# EAGLE design PCB-MicroGPIO (EAGLE 7.5.0)

## Sheet 1 of 2
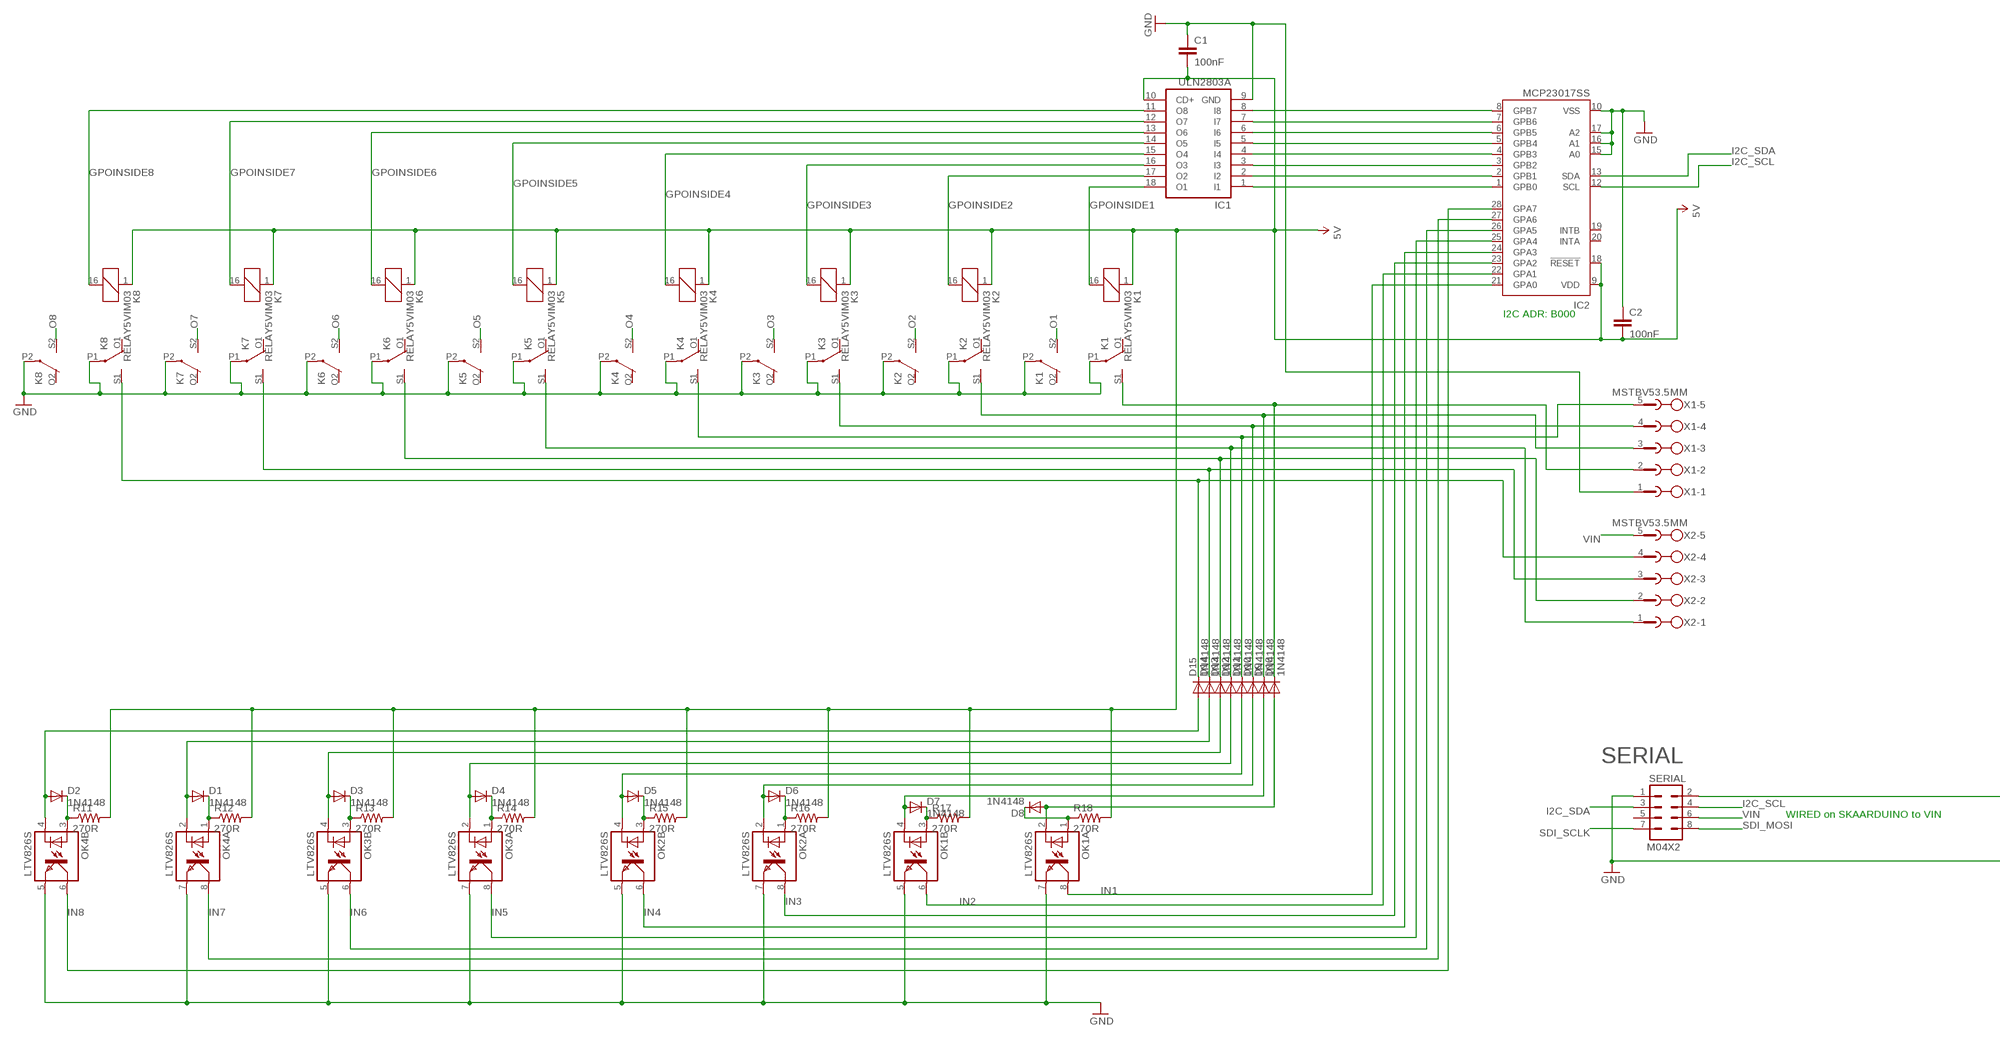
[diagram p0: schematic, sheet 1, part 1 of 2]
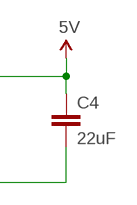
[diagram p1: schematic, sheet 1, part 2 of 2]

### Parts
C1  100nF  CAP0603-CAP  [0603-CAP]
C2  100nF  CAP0603-CAP  [0603-CAP]
C4  22uF  CAP0805  [0805]
D1  1N4148  DIODESOD  [SOD-323]
D2  1N4148  DIODESOD  [SOD-323]
D3  1N4148  DIODESOD  [SOD-323]
D4  1N4148  DIODESOD  [SOD-323]
D5  1N4148  DIODESOD  [SOD-323]
D6  1N4148  DIODESOD  [SOD-323]
D7  1N4148  DIODESOD  [SOD-323]
D8  1N4148  DIODESOD  [SOD-323]
D9  1N4148  DIODESOD  [SOD-323]
D10  1N4148  DIODESOD  [SOD-323]
D11  1N4148  DIODESOD  [SOD-323]
D12  1N4148  DIODESOD  [SOD-323]
D13  1N4148  DIODESOD  [SOD-323]
D14  1N4148  DIODESOD  [SOD-323]
D15  1N4148  DIODESOD  [SOD-323]
D16  1N4148  DIODESOD  [SOD-323]
IC1  ULN2803A  ULN2803ASO18W  [SO18W]
IC2  MCP23017SS  [SSOP28]
K1  RELAY5VIM03  [DS2Y]
K2  RELAY5VIM03  [DS2Y]
K3  RELAY5VIM03  [DS2Y]
K4  RELAY5VIM03  [DS2Y]
K5  RELAY5VIM03  [DS2Y]
K6  RELAY5VIM03  [DS2Y]
K7  RELAY5VIM03  [DS2Y]
K8  RELAY5VIM03  [DS2Y]
OK1  LTV826S  [DIL8-SMD]
OK2  LTV826S  [DIL8-SMD]
OK3  LTV826S  [DIL8-SMD]
OK4  LTV826S  [DIL8-SMD]
R11  270R  RESISTOR0603-RES  [0603-RES]
R12  270R  RESISTOR0603-RES  [0603-RES]
R13  270R  RESISTOR0603-RES  [0603-RES]
R14  270R  RESISTOR0603-RES  [0603-RES]
R15  270R  RESISTOR0603-RES  [0603-RES]
R16  270R  RESISTOR0603-RES  [0603-RES]
R17  270R  RESISTOR0603-RES  [0603-RES]
R18  270R  RESISTOR0603-RES  [0603-RES]
SERIAL  M04X2  [2X4]
X1  MSTBV53.5MM  [MSTBV5-3.5]
X2  MSTBV53.5MM  [MSTBV5-3.5]

### Nets
5V [Power]: C1.2 C2.2 C4.1 IC1.10(CD+) IC2.9(VDD) IC2.18(!RESET) K1.1 K2.1 K3.1 K4.1 K5.1 K6.1 K7.1 K8.1 R11.2 R12.2 R13.2 R14.2 R15.2 R16.2 R17.2 R18.2 SERIAL.2
GND [Power]: C1.1 C2.1 C4.2 IC1.9(GND) IC2.10(VSS) IC2.15(A0) IC2.16(A1) IC2.17(A2) K1.P1(2:P) K1.P2(3:P) K2.P1(2:P) K2.P2(3:P) K3.P1(2:P) K3.P2(3:P) K4.P1(2:P) K4.P2(3:P) K5.P1(2:P) K5.P2(3:P) K6.P1(2:P) K6.P2(3:P) K7.P1(2:P) K7.P2(3:P) K8.P1(2:P) K8.P2(3:P) OK1.5(B:EMIT) OK1.7(A:EMIT) OK2.5(B:EMIT) OK2.7(A:EMIT) OK3.5(B:EMIT) OK3.7(A:EMIT) OK4.5(B:EMIT) OK4.7(A:EMIT) SERIAL.1 X1.1
GPOINSIDE1: IC1.18(O1) K1.16
GPOINSIDE2: IC1.17(O2) K2.16
GPOINSIDE3: IC1.16(O3) K3.16
GPOINSIDE4: IC1.15(O4) K4.16
GPOINSIDE5: IC1.14(O5) K5.16
GPOINSIDE6: IC1.13(O6) K6.16
GPOINSIDE7: IC1.12(O7) K7.16
GPOINSIDE8: IC1.11(O8) K8.16
I2C_SCL: IC2.12(SCL) SERIAL.4
I2C_SDA: IC2.13(SDA) SERIAL.3
IN1: IC2.21(GPA0) OK1.8(A:COL)
IN2: IC2.22(GPA1) OK1.6(B:COL)
IN3: IC2.23(GPA2) OK2.8(A:COL)
IN4: IC2.24(GPA3) OK2.6(B:COL)
IN5: IC2.25(GPA4) OK3.8(A:COL)
IN6: IC2.26(GPA5) OK3.6(B:COL)
IN7: IC2.27(GPA6) OK4.8(A:COL)
IN8: IC2.28(GPA7) OK4.6(B:COL)
N$1 [INput lines]: D2.2(A) D15.2(A) OK4.4(B:C)
N$2 [INput lines]: D1.2(A) D14.2(A) OK4.2(A:C)
N$3 [INput lines]: D3.2(A) D13.2(A) OK3.4(B:C)
N$4 [INput lines]: D4.2(A) D12.2(A) OK3.2(A:C)
N$5: IC1.1(I1) IC2.1(GPB0)
N$6 [INput lines]: D5.2(A) D11.2(A) OK2.4(B:C)
N$7 [INput lines]: D6.2(A) D10.2(A) OK2.2(A:C)
N$8 [INput lines]: D7.2(A) D9.2(A) OK1.4(B:C)
N$9 [INput lines]: D8.2(A) D16.2(A) OK1.2(A:C)
N$13: D2.1(C) OK4.3(B:A) R11.1
N$15: D1.1(C) OK4.1(A:A) R12.1
N$16: D3.1(C) OK3.3(B:A) R13.1
N$17: D4.1(C) OK3.1(A:A) R14.1
N$19: D5.1(C) OK2.3(B:A) R15.1
N$20: D6.1(C) OK2.1(A:A) R16.1
N$21: D7.1(C) OK1.3(B:A) R17.1
N$23: D8.1(C) OK1.1(A:A) R18.1
N$34: IC1.2(I2) IC2.2(GPB1)
N$35: IC1.3(I3) IC2.3(GPB2)
N$36: IC1.4(I4) IC2.4(GPB3)
N$37: IC1.5(I5) IC2.5(GPB4)
N$38: IC1.6(I6) IC2.6(GPB5)
N$39: IC1.7(I7) IC2.7(GPB6)
N$40: IC1.8(I8) IC2.8(GPB7)
N$49 [RELAY LINES]: D16.1(C) K1.S1(2:S) X1.2
N$55 [RELAY LINES]: D12.1(C) K5.S1(2:S) X2.1
N$60 [RELAY LINES]: D9.1(C) K2.S1(2:S) X1.3
N$61 [RELAY LINES]: D10.1(C) K3.S1(2:S) X1.4
N$62 [RELAY LINES]: D11.1(C) K4.S1(2:S) X1.5
N$64 [RELAY LINES]: D13.1(C) K6.S1(2:S) X2.2
N$65 [RELAY LINES]: D14.1(C) K7.S1(2:S) X2.3
N$66 [RELAY LINES]: D15.1(C) K8.S1(2:S) X2.4
O1: K1.S2(3:S)
O2: K2.S2(3:S)
O3: K3.S2(3:S)
O4: K4.S2(3:S)
O5: K5.S2(3:S)
O6: K6.S2(3:S)
O7: K7.S2(3:S)
O8: K8.S2(3:S)
SDI_MOSI: SERIAL.8
SDI_SCLK: SERIAL.7
VIN: SERIAL.6 X2.5
Unconnected: IC2.19(INTB) IC2.20(INTA) K1.O1(2:O) K1.O2(3:O) K2.O1(2:O) K2.O2(3:O) K3.O1(2:O) K3.O2(3:O) K4.O1(2:O) K4.O2(3:O) K5.O1(2:O) K5.O2(3:O) K6.O1(2:O) K6.O2(3:O) K7.O1(2:O) K7.O2(3:O) K8.O1(2:O) K8.O2(3:O) SERIAL.5

### Notes on the sheet
- I2C ADR: B000
- SERIAL
- WIRED on SKAARDUINO to VIN

## Sheet 2 of 2

## Library data of the parts
C1 C2 C4 = SparkFun:CAP: Capacitor Standard 0603 ceramic capacitor, and 0.1" leaded capacitor.
D1-D16 = SparkFun:DIODE: Diode These are standard reverse protection diodes and small signal diodes. SMA package can handle up to about 1A. SOD-323 can handle about 200mA. What the SOD-323 package when ordering, there are some mfgs out there that are 5-pin packages.
IC1 = uln-udn:ULN2803A: DRIVER ARRAY
IC2 = microchip:MCP23017: http://ww1.microchip.com/downloads/en/DeviceDoc/21952a.pdf Source: http://ww1.microchip.com/downloads/en/DeviceDoc/21952a.pdf; MF: MICROCHIP; MPN: MCP23017-E/SS; OC_FARNELL: 1467674; OC_NEWARK: 31K2960
K1-K8 = SKAARHOJ:RELAY5V: RELAY 2 x switch, AxiCom 150 mW 5V
OK1-OK4 = optocoupler:LTV826: OPTO COUPLER Source: LITEON, LTV816.pdf; OC_FARNELL: unknown; OC_NEWARK: unknown
R11-R18 = SparkFun:RESISTOR: Resistor Basic schematic elements and footprints for 0603, 1206, and PTH resistors.
SERIAL = SparkFun:M04X2
X1 X2 = SKAARHOJ:MSTBV5: PHOENIX

## Net classes
0 default: width 0.203 mm, drill 0.406 mm, clearance 0.203 mm
1 Power: width 0.406 mm, drill 0.61 mm, clearance 0.305 mm
2 RELAY LINES: width 0.406 mm, drill 0.61 mm, clearance 0.305 mm
3 INput lines: width 0.203 mm, drill 0.406 mm, clearance 0.254 mm

## Board
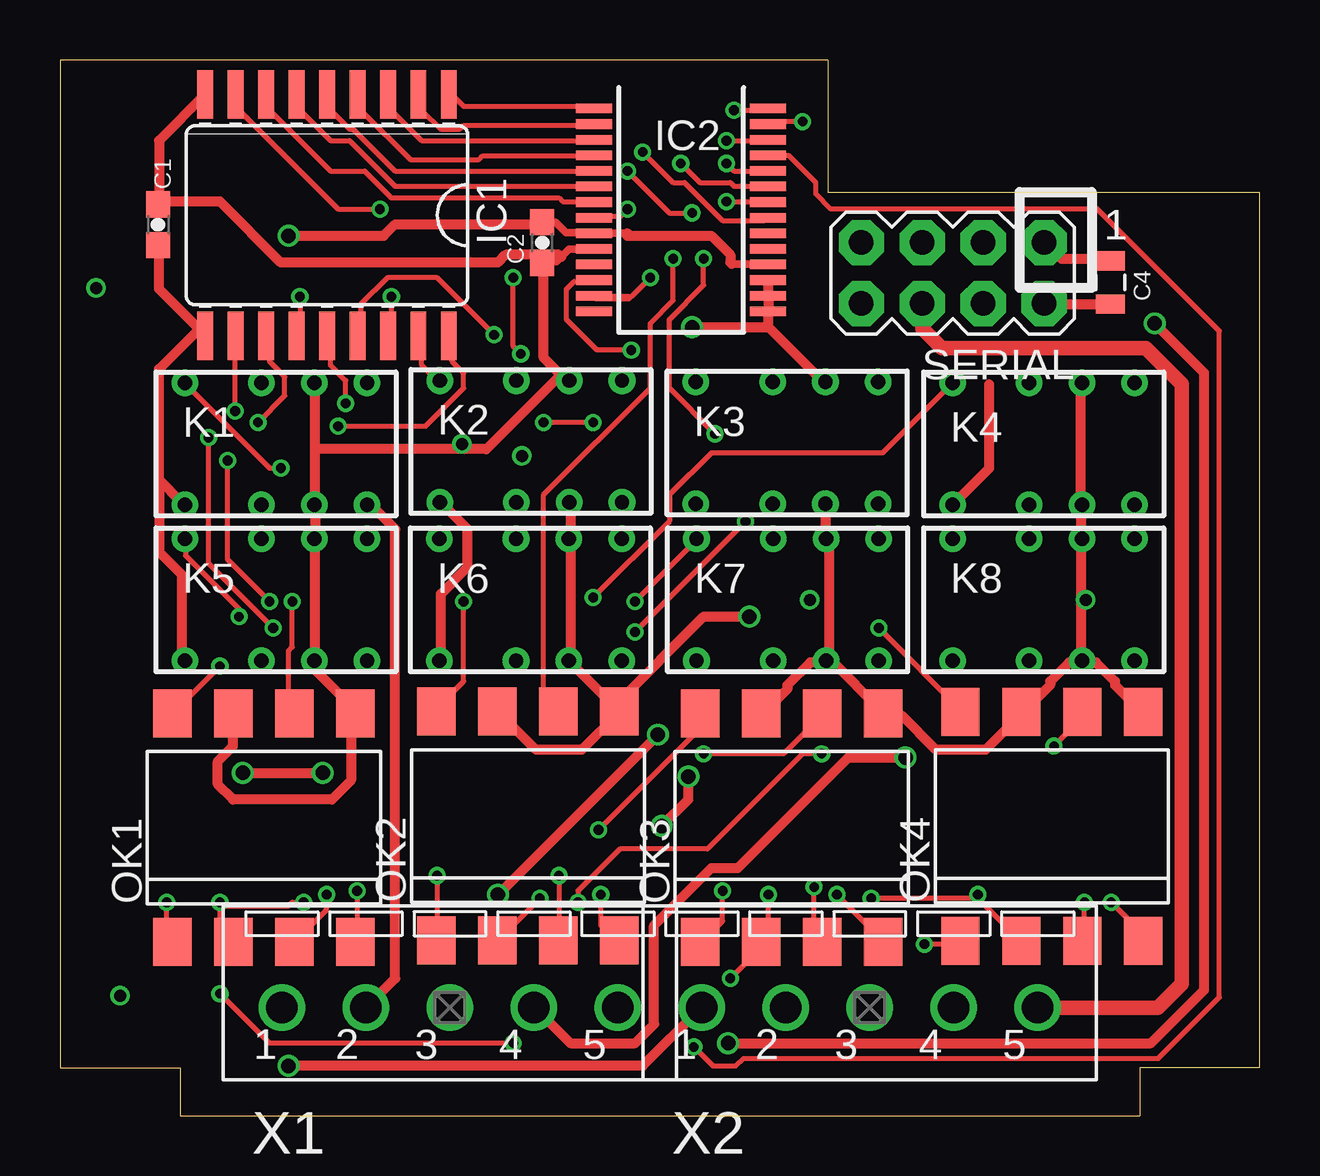
[diagram p2: board, top side]
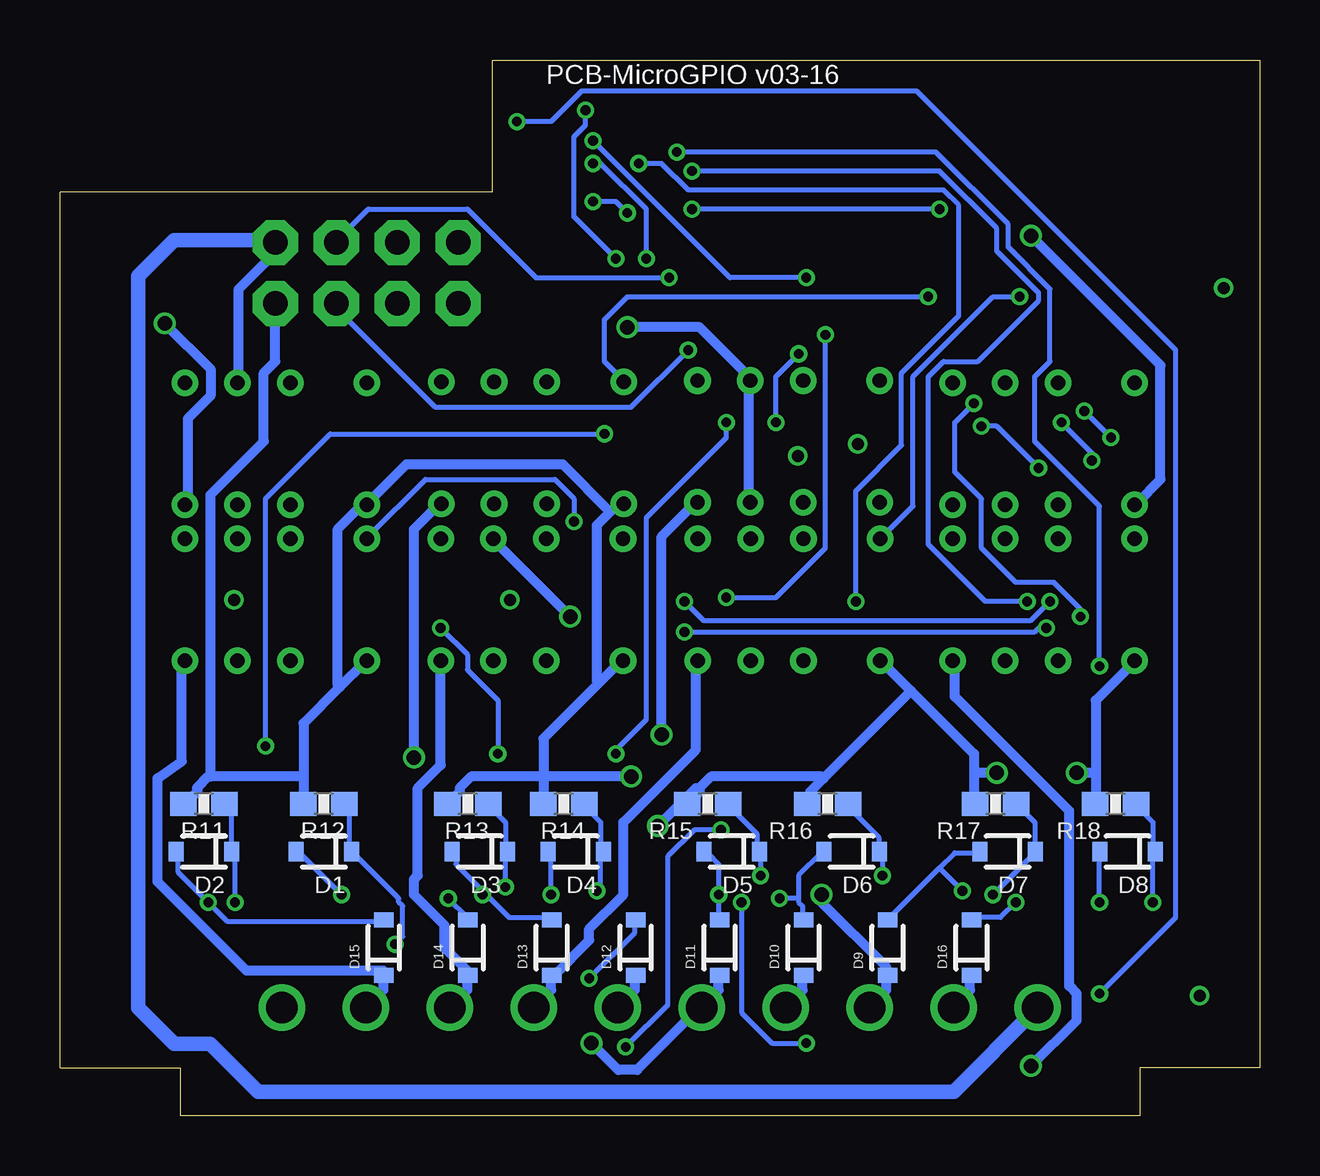
[diagram p3: board, bottom side, seen from below]

Size 50 x 44 mm. Coordinates in mm from the lower left corner, seen from the top.
Outline: 50,2 50,38.5 32,38.5 32,44 0,44 0,2 5,2 5,0 45,0 45,2 50,2
Copper layers (1*16): Top 0.035mm / dielectric 1.5mm / Bottom 0.035mm
Design rules "Fusion_eagle_rule_v1.1": minimum track width 6mil, minimum drill 12mil, track to track 6mil, track to pad 6mil, pad to pad 6mil, via to via 6mil, smd to smd 0mil, copper to edge 10mil, drill to drill 10mil, minimum pad ring 10mil, minimum via ring 6mil, stop-mask expansion 2mil, vias tented up to drill 100mil, thermal gap 10mil

### Footprints (pad centres in the part's own frame; a part is rotated, then mirrored left to right if it is on the bottom)
0603-CAP = smd 1.1 x 1: 1 -0.85,0; 2 0.85,0
0805 = smd 0.8 x 1.2: 1 -0.9,0; 2 0.9,0
SOD-323 = smd 0.63 x 0.83: 1 -1.15,0; 2 1.15,0
SO18W = smd 0.66 x 2.032: 1 -5.08,-5.029; 2 -3.81,-5.029; 3 -2.54,-5.029; 4 -1.27,-5.029; 5 0,-5.029; 6 1.27,-5.029; 7 2.54,-5.029; 8 3.81,-5.029; 9 5.08,-5.029; 10 5.08,5.029; 11 3.81,5.029; 12 2.54,5.029; 13 1.27,5.029; 14 0,5.029; 15 -1.27,5.029; 16 -2.54,5.029; 17 -3.81,5.029; 18 -5.08,5.029
SSOP28 = smd 0.4 x 1.5: 1 -4.225,-3.625; 2 -3.575,-3.625; 3 -2.925,-3.625; 4 -2.275,-3.625; 5 -1.625,-3.625; 6 -0.975,-3.625; 7 -0.325,-3.625; 8 0.325,-3.625; 9 0.975,-3.625; 10 1.625,-3.625; 11 2.275,-3.625; 12 2.925,-3.625; 13 3.575,-3.625; 14 4.225,-3.625; 15 4.225,3.625; 16 3.575,3.625; 17 2.925,3.625; 18 2.275,3.625; 19 1.625,3.625; 20 0.975,3.625; 21 0.325,3.625; 22 -0.325,3.625; 23 -0.975,3.625; 24 -1.625,3.625; 25 -2.275,3.625; 26 -2.925,3.625; 27 -3.575,3.625; 28 -4.225,3.625
DS2Y = drill 0.6: 1 1.2,0.46; 16 1.2,5.54; O1 4.4,0.46; O2 4.4,5.54; P1 6.6,0.46; P2 6.6,5.54; S1 8.8,0.46; S2 8.8,5.54
DIL8-SMD = smd 1.6 x 2: 1 -3.81,-4.77; 2 -1.27,-4.77; 3 1.27,-4.77; 4 3.81,-4.77; 5 3.81,4.77; 6 1.27,4.77; 7 -1.27,4.77; 8 -3.81,4.77
0603-RES = smd 1.1 x 1: 1 -0.85,0; 2 0.85,0
2X4 = drill 1.016 pad 1.88 octagon: 1 -3.81,-1.27; 2 -3.81,1.27; 3 -1.27,-1.27; 4 -1.27,1.27; 5 1.27,-1.27; 6 1.27,1.27; 7 3.81,-1.27; 8 3.81,1.27
MSTBV5-3.5 = drill 1.3: 1 -7,0; 2 -3.5,0; 3 0,0; 4 3.5,0; 5 7,0

### Placement (x,y rotation side)
C1  4.09,37.13 270 top
C2  20.1,36.39 90 top
C4  43.78,34.73 90 top
D1  39,11 180 bottom
D2  44,11 180 bottom
D3  32.5,11 180 bottom
D4  28.5,11 180 bottom
D5  22,11 180 bottom
D6  17,11 180 bottom
D7  10.5,11 180 bottom
D8  5.5,11 180 bottom
D9  15.5,7 90 bottom
D10  19,7 90 bottom
D11  22.5,7 90 bottom
D12  26,7 90 bottom
D13  29.5,7 90 bottom
D14  33,7 90 bottom
D15  36.5,7 90 bottom
D16  12,7 90 bottom
IC1  11.13,37.53 180 top
IC2  25.89,37.75 270 top
K1  4,25 0 top
K2  14.63,25.1 0 top
K3  25.31,25.04 0 top
K4  36,25 0 top
K5  4,18.5 0 top
K6  14.61,18.5 0 top
K7  25.33,18.5 0 top
K8  36,18.5 0 top
OK1  8.5,12 0 top
OK2  19.5,12.06 0 top
OK3  30.5,12 0 top
OK4  41.34,12.05 0 top
R11  44,13 180 bottom
R12  39,13 180 bottom
R13  33,13 180 bottom
R14  29,13 180 bottom
R15  23,13 180 bottom
R16  18,13 180 bottom
R17  11,13 180 bottom
R18  6,13 180 bottom
SERIAL  37.21,35.12 180 top
X1  16.25,4.5 0 top
X2  33.75,4.5 0 top

### Tracks (layer width: path | path; a pad name or v marks a point on that pad's centre or on a via)
5V  (via drill 0.61)
  Top 0.305: C2.2 20.66,37.24 21.1,36.8 22.24,36.8 IC2.9 23.65,36.77 23.68,36.77 23.7,36.8 | IC2.18 29.49,35.5 28,35.5
  Top 0.406: C4.1 43.66,33.81 41.12,33.81 SERIAL.2 | 38.73,30.48 38.73,26.99 37.31,25.56 K4.1 | K2.1 15.88,25.4 16.03,25.4 16.99,24.45 16.99,22.86 15.88,21.75 15.88,19.05 K6.1 | 5.79,32.78 6.03,32.54 IC1.10 | 5.79,32.78 4.13,34.45 4.13,36.2 C1.2 | 28,35.5 27.94,35.56 27.94,35.88 27.15,36.67 23.65,36.67 23.65,36.77 | v9.53,36.67 13.49,36.67 13.97,37.15 20,37.15 C2.2 | 5.79,32.78 4.13,31.11 4.13,26.51 | 4.13,26.51 5.08,25.56 K1.1 | 4.13,26.51 4.13,23.5 5.08,22.54 5.08,19.05 K5.1 | v7.62,14.29 v10.95,14.29 | v26.19,14.13 26.19,13.18 v25.08,12.06
  Bottom 0.406: 29.84,14.13 29.84,15.72 27.54,18.02 | 29.84,14.13 29.84,13.02 R14.2 | 27.54,18.02 26.67,18.89 K7.1 | 29.84,14.13 32.86,14.13 33.34,13.65 33.34,13.49 33.81,13.02 R13.2 | 27.07,25.16 27.62,24.61 27.62,18.1 27.54,18.02 | 27.07,25.16 26.83,25.4 26.51,25.4 K3.1 | 39.85,14.13 39.85,16.35 38.34,17.86 | 39.85,14.13 39.85,13.02 R12.2 | 38.34,17.86 37.31,18.89 K8.1 | 39.85,14.13 43.72,14.13 | 43.72,14.13 43.81,14.13 44.29,13.65 44.29,13.49 44.77,13.02 R11.2 | 38.34,17.86 38.42,17.94 38.42,24.45 37.47,25.4 37.31,25.4 K4.1 37.15,25.56 35.56,27.15 29.05,27.15 27.07,25.16 | 11.91,14.29 11.91,15.08 14.53,17.7 | 11.91,14.29 11.91,13.02 R17.2 | 14.53,17.7 15.72,18.89 K6.1 | 14.53,17.7 18.18,14.05 | 18.18,14.05 18.73,13.49 18.73,13.02 R16.2 | 23.34,13.65 23.34,13.49 23.81,13.02 R15.2 | 23.34,13.65 22.86,14.13 18.26,14.13 18.18,14.05 | 6.83,14.29 6.83,17.3 5.24,18.89 K5.1 | 6.83,14.29 6.83,13.02 R18.2 | v9.53,36.67 4.13,31.27 4.13,26.51 5.08,25.56 K1.1 | v10.95,14.29 11.91,14.29 | 6.83,14.29 v7.62,14.29 | v26.19,14.13 29.84,14.13 | v25.08,12.06 23.5,13.65 23.34,13.65 | 43.72,14.13 43.72,25.88 41.5,28.1 41.5,30.96 41.02,31.43 41.02,33.81 SERIAL.2
GND  (via drill 0.5, 0.61)
  Top 0.305: IC2.10 21.23,36.12 20.89,35.79 20.7,35.6 20.16,35.6 C2.1
  Top 0.406: 10.64,27.78 10.64,25.56 K1.P1 10.64,25.4 10.64,24.13 K5.P2 10.64,23.97 10.64,19.05 K5.P1 10.64,18.89 10.64,18.57 12.38,16.83 OK1.5 12.13,16.67 12.13,13.97 11.34,13.18 7.21,13.18 6.58,13.81 6.58,14.76 7.21,15.4 7.21,16.67 OK1.7 | 10.64,27.78 10.64,30.48 K1.P2 | K3.P1 31.91,25.4 31.91,24.13 K7.P2 32.07,23.97 32.07,19.21 K7.P1 | OK3.7 29.37,16.83 30.32,17.78 30.32,17.94 31.27,18.89 31.91,18.89 K7.P1 | K7.P1 32.07,19.05 34.29,16.83 OK3.5 34.45,16.67 35.08,16.67 36.51,15.24 38.58,15.24 40.01,16.67 OK4.7 40.16,16.83 41.27,17.94 41.27,18.1 42.07,18.89 42.55,18.89 K8.P1 | OK4.5 45.09,16.83 43.97,17.94 43.97,18.1 43.18,18.89 42.7,18.89 K8.P1 | C4.2 43.66,35.72 41.75,35.72 41.12,36.35 SERIAL.1 | K4.P2 42.55,30.48 42.55,25.56 K4.P1 42.55,25.4 42.55,24.13 K8.P2 42.55,23.97 42.55,19.05 K8.P1 | OK2.7 18.26,16.83 19.84,15.24 21.75,15.24 23.34,16.83 OK2.5 | OK2.5 23.18,16.99 21.27,18.89 K6.P1 21.27,19.05 21.27,23.97 K6.P2 21.27,24.13 21.27,25.4 K2.P1 | IC2.17 29.53,34.77 29.53,34.29 IC2.16 29.53,34.13 29.53,33.66 IC2.15 29.53,33.34 29.53,32.86 | 29.53,32.86 31.75,30.64 K3.P2 | IC1.9 6.03,42.55 4.13,40.64 4.13,38.1 C1.1 4.29,38.1 6.67,38.1 9.21,35.56 18.26,35.56 18.57,35.88 20.8,35.88 20.89,35.79 | C2.1 20.16,35.4 20.16,31.59 21.11,30.64 K2.P2 20.8,30.8 17.78,27.78 10.64,27.78 | v26.35,32.86 29.53,32.86 | v28.73,20.8 26.83,20.8 23.18,17.14 OK2.5
  Bottom 0.406: SERIAL.1 41.12,36.35 41.12,35.88 42.55,34.45 42.55,30.64 K4.P2 | K2.P1 21.27,25.56 21.27,30.48 K2.P2 21.27,30.8 23.34,32.86 v26.35,32.86 | v28.73,20.8 31.91,23.97 K7.P2 | X1.1 9.28,4.6 9.37,4.38
  Bottom 0.61: 9.37,4.45 9.37,4.38 12.75,1 41.75,1 43.75,3 45.25,3 46.75,4.5 46.75,35 45.25,36.5 41.13,36.5 SERIAL.1
  other vias: 2.5,5 1.5,34.5 19.25,27.5 31.25,21.5 42.75,21.5 16.75,28
GPOINSIDE1  (via drill 0.41)
  Top 0.203: v11.59,28.73 15.24,28.73 16.83,30.32 16.83,30.96 16.35,31.43 16.35,32.38 IC1.18 | v9.21,26.99 8.73,26.99 5.24,30.48 K1.16
  Bottom 0.203: v11.59,28.73 10.95,28.73 v9.21,26.99
GPOINSIDE2
  Top 0.203: IC1.17 15.08,32.38 15.08,31.27 15.72,30.64 K2.16
GPOINSIDE3  (via drill 0.41)
  Top 0.203: v13.81,34.13 13.81,32.54 IC1.16
  Bottom 0.203: v13.81,34.13 26.35,34.13 27.3,33.18 27.3,31.43 26.51,30.64 K3.16
GPOINSIDE4  (via drill 0.41)
  Top 0.203: v18.1,32.54 15.72,34.92 13.65,34.92 12.54,33.81 12.54,32.54 IC1.15 | v22.23,21.59 25.4,24.77 25.4,25.88 27.15,27.62 34.29,27.62 37.15,30.48 K4.16
  Bottom 0.203: v18.1,32.54 18.1,23.65 20.16,21.59 v22.23,21.59
GPOINSIDE5  (via drill 0.41)
  Top 0.203: v11.91,29.69 11.91,30.64 11.27,31.27 11.27,32.38 IC1.14 | v7.46,20.8 7.46,21.11 5.24,23.34 5.24,23.97 K5.16
  Bottom 0.203: v11.91,29.69 12.7,28.89 12.7,26.83 11.59,25.72 11.59,23.65 10.16,22.23 8.57,22.23 7.46,21.11 v7.46,20.8
GPOINSIDE6  (via drill 0.41)
  Top 0.203: v10,34.13 10,32.54 IC1.13
  Bottom 0.203: v10,34.13 11.11,34.13 14.45,30.8 14.45,25.4 15.72,24.13 K6.16
GPOINSIDE7  (via drill 0.41)
  Top 0.203: v8.26,28.89 9.37,30 9.37,30.8 8.73,31.43 8.73,32.38 IC1.12 | v6.99,27.3 6.99,23.18 v8.73,21.43 | v23.97,21.43 26.51,23.97 K7.16
  Bottom 0.203: v8.26,28.89 6.99,27.62 v6.99,27.3 | v8.73,21.43 9.53,20.64 23.18,20.64 v23.97,21.43
GPOINSIDE8  (via drill 0.41)
  Top 0.203: v7.3,29.37 7.3,32.38 IC1.11 | v6.19,28.26 6.19,23.02 v8.89,20.32 | v28.57,24.77 v23.97,20.16
  Bottom 0.203: v6.19,28.26 v7.3,29.37 | v8.89,20.32 9.21,20.32 9.37,20.16 v23.97,20.16 | v28.57,24.77 28.57,25.72 29.37,26.51 34.77,26.51 37.15,24.13 K8.16
I2C_SCL  (via drill 0.41)
  Top 0.203: v23.81,31.91 22.38,31.91 21.11,33.18 21.11,34.45 21.43,34.77 22.23,34.77 IC2.12
  Bottom 0.203: v23.81,31.91 26.19,29.53 34.36,29.53 38.33,33.5 38.33,33.81 SERIAL.4
I2C_SDA  (via drill 0.41)
  Top 0.203: v24.61,34.92 23.81,34.13 23.7,34.1
  Top 0.305: IC2.13 22.34,34.1 23.7,34.1
  Bottom 0.203: v24.61,34.92 30.16,34.92 33.02,37.78 37.15,37.78 38.42,36.51 SERIAL.3
IN1  (via drill 0.41)
  Top 0.203: v24.29,40.16 25.56,38.89 26.04,38.89 27.62,37.31 29.37,37.31 IC2.21 | v6.67,18.73 4.76,16.83 OK1.8
  Bottom 0.203: v24.29,40.16 13.49,40.16 10.48,37.15 10.48,36.2 8.73,34.45 8.73,31.43 9.37,30.8 9.37,28.1 6.67,25.4 v6.67,18.73
IN2  (via drill 0.41)
  Top 0.203: v27.78,38.1 29.37,38.1 IC2.22 | v26.35,37.62 25.4,37.62 v23.65,39.37 | v9.68,21.43 9.68,19.53 9.53,19.37 9.53,16.99 9.68,16.83 OK1.6
  Bottom 0.203: v27.78,38.1 26.83,38.1 v26.35,37.62 | v23.65,39.37 13.34,39.37 10.95,36.99 10.95,36.04 9.21,34.29 9.21,33.97 11.75,31.43 13.18,31.43 13.81,30.8 13.81,23.81 11.43,21.43 v9.68,21.43
IN3  (via drill 0.41)
  Top 0.203: v25.88,39.69 26.67,38.89 27.94,38.89 28.1,38.73 29.37,38.73 IC2.23 | v16.83,21.43 16.83,18.1 15.72,16.99 OK2.8
  Bottom 0.203: v25.88,39.69 24.92,39.69 23.81,38.58 13.18,38.58 12.54,37.94 12.54,33.34 14.92,30.96 14.92,27.94 16.83,26.04 v16.83,21.43
IN4  (via drill 0.41)
  Top 0.203: v27.78,39.69 28.1,39.37 29.37,39.37 IC2.24 | v25.56,35.72 25.56,33.97 24.61,33.02 24.61,30.32 20.16,25.88 20.16,17.46 20.64,16.99 OK2.6
  Bottom 0.203: v27.78,39.69 27.46,39.69 25.56,37.78 v25.56,35.72
IN5  (via drill 0.41)
  Top 0.203: v26.42,2.86 27.21,2.06 28.17,2.06 28.48,2.38 45.79,2.38 48.33,4.92 48.33,32.7 43.25,37.78 32.13,37.78 31.5,38.42 31.5,38.89 30.39,40.01 29.59,40.01 IC2.25 | v22.45,11.91 26.58,16.03 26.58,16.67 OK3.8
  Bottom 0.203: v26.42,2.86 24.67,4.6 24.67,10.79 23.56,11.91 v22.45,11.91
IN6  (via drill 0.41)
  Top 0.203: v27.78,40.64 29.37,40.64 IC2.26 | v18.89,34.92 18.89,32.07 v19.21,31.75 | v22.23,28.89 v20.16,28.89 | v26.83,15.08 30.16,15.08 31.75,16.67 OK3.6
  Bottom 0.203: v27.78,40.64 22.07,34.92 v18.89,34.92 | v19.21,31.75 20.16,30.8 v20.16,28.89 | v22.23,28.89 22.23,28.26 25.56,24.92 25.56,16.51 26.83,15.24 v26.83,15.08
IN7  (via drill 0.41)
  Top 0.203: v30.96,41.43 29.53,41.43 IC2.27 | v6.67,5.08 8.73,3.02 v18.89,3.02 | v21.59,8.89 21.59,9.37 23.34,11.11 26.99,11.11 30.96,15.08 v31.75,15.08 | v34.13,20.32 37.62,16.83 OK4.8
  Bottom 0.203: v30.96,41.43 29.53,41.43 28.26,42.7 14.29,42.7 3.49,31.91 3.49,8.26 v6.67,5.08 | v18.89,3.02 20.32,3.02 21.59,4.29 v21.59,8.89 | v31.75,15.08 31.75,17.3 33.02,18.57 33.02,19.21 v34.13,20.32
IN8  (via drill 0.41)
  Top 0.203: v28.1,41.91 29.37,41.91 IC2.28 | v26.83,35.72 26.83,34.61 25.4,33.18 25.4,30.32 v27.3,28.42 | v41.43,15.4 42.7,16.67 OK4.6
  Bottom 0.203: v28.1,41.91 28.1,41.27 28.57,40.8 28.57,37.47 v26.83,35.72 | v27.3,28.42 38.73,28.42 41.43,25.72 v41.43,15.4
N$1  (via drill 0.41)
  Top 0.203: v43.81,8.89 45.09,7.62 45.09,7.3 OK4.4
  Bottom 0.203: D15.2 36.51,8.1 43.02,8.1 v43.81,8.89 45.09,10.16 45.09,10.95 D2.2
N$2  (via drill 0.41)
  Top 0.203: 38.26,9.05 v33.81,9.05 | 38.26,9.05 40.01,7.3 OK4.2 | 38.26,9.05 v38.26,9.21
  Bottom 0.203: v33.81,9.05 33.02,8.26 D14.2 | v38.26,9.21 40.01,10.95 D1.2
N$3  (via drill 0.41)
  Top 0.203: v32.38,9.21 34.29,7.3 OK3.4
  Bottom 0.203: 32.23,9.21 33.5,10.48 33.5,10.95 D3.2 | 32.23,9.21 31.27,8.26 29.53,8.26 D13.2 | 32.23,9.21 v32.38,9.21
N$4  (via drill 0.41)
  Top 0.203: v27.94,5.71 29.37,7.14 OK3.2 29.37,7.3 29.53,7.46 v29.53,9.21
  Bottom 0.203: v27.94,5.71 26.04,7.62 26.04,8.1 D12.2 | v29.53,9.21 29.53,10.95 D4.2
N$5
  Top 0.203: IC2.1 22.23,42.07 16.83,42.07 16.35,42.55 IC1.1
N$6  (via drill 0.41)
  Top 0.203: v22.54,9.21 22.54,7.94 23.18,7.3 OK2.4
  Bottom 0.203: D11.2 22.54,8.26 v22.54,9.21 22.54,10.48 23.02,10.95 D5.2
N$7  (via drill 0.41)
  Top 0.203: v20,9.05 18.26,7.3 OK2.2
  Bottom 0.203: 19.21,9.05 19.21,10 18.26,10.95 D6.2 | 19.21,9.05 19.21,8.89 19.05,8.73 19.05,8.26 D10.2 | 19.21,9.05 v20,9.05
N$8  (via drill 0.41)
  Top 0.203: v12.38,9.37 12.38,7.3 OK1.4
  Bottom 0.203: 13.34,10.32 15.4,8.26 D9.2 | 13.34,10.32 12.7,10.95 11.75,10.95 D7.2 | 13.34,10.32 v12.38,9.37
N$9  (via drill 0.41)
  Top 0.203: 6.67,8.73 6.67,7.78 7.14,7.3 OK1.2 | v10.16,8.89 9.68,8.89 9.53,8.73 6.67,8.73 | 6.67,8.73 v6.67,8.89
  Bottom 0.203: v6.67,8.89 6.67,10.95 D8.2 | v10.16,8.89 10.79,8.26 11.91,8.26 D16.2
N$13  (via drill 0.41)
  Top 0.203: v42.7,8.89 42.7,7.3 OK4.3
  Bottom 0.203: R11.1 43.02,12.86 42.86,12.7 42.86,11.11 D2.1 42.7,10.95 v42.7,8.89
N$15  (via drill 0.41)
  Top 0.203: v36.04,7.14 37.47,7.14 OK4.1
  Bottom 0.203: R12.1 38.1,12.86 37.94,12.7 37.94,11.11 D1.1 37.78,10.95 35.88,9.05 35.88,8.89 35.72,8.73 35.72,7.46 v36.04,7.14
N$16  (via drill 0.41)
  Top 0.203: v31.43,9.53 31.43,7.62 31.75,7.3 OK3.3
  Bottom 0.203: R13.1 32.07,12.86 31.43,12.22 31.43,11.11 D3.1 31.43,10.95 v31.43,9.53
N$17  (via drill 0.41)
  Top 0.203: v27.62,9.37 27.62,8.1 26.83,7.3 OK3.1
  Bottom 0.203: R14.1 28.1,12.86 27.46,12.22 27.46,11.11 D4.1 27.46,10.95 27.46,9.53 v27.62,9.37
N$19  (via drill 0.41)
  Top 0.203: v20.8,10 20.8,7.3 OK2.3
  Bottom 0.203: R15.1 22.07,12.86 20.95,11.75 20.95,11.11 D5.1 20.8,10.95 v20.8,10
N$20  (via drill 0.41)
  Top 0.203: v15.72,10 15.72,7.3 OK2.1
  Bottom 0.203: R16.1 17.14,12.86 15.88,11.59 15.88,11.11 D6.1 15.72,10.95 v15.72,10
N$21  (via drill 0.41)
  Top 0.203: v11.11,9.21 11.11,8.57 OK1.3
  Bottom 0.203: R17.1 10,12.86 9.37,12.22 9.37,11.11 D7.1 9.37,10.95 v11.11,9.21
N$23  (via drill 0.41)
  Top 0.203: v4.45,8.89 4.45,7.46 4.6,7.3 OK1.1
  Bottom 0.203: R18.1 5.08,12.86 4.45,12.22 4.45,11.11 D8.1 4.45,10.95 v4.45,8.89
N$34
  Top 0.203: IC2.2 22.23,41.27 16.83,41.27 16.67,41.12 15.88,41.12 15.08,41.91 15.08,42.55 IC1.2
N$35
  Top 0.203: IC2.3 22.23,40.64 15.08,40.64 13.81,41.91 13.81,42.55 IC1.3
N$36
  Top 0.203: IC2.4 22.23,40.01 17.62,40.01 17.46,39.85 14.61,39.85 12.54,41.91 12.54,42.55 IC1.4
N$37
  Top 0.203: IC2.5 22.23,39.37 13.97,39.37 12.22,41.12 12.06,41.12 11.27,41.91 11.27,42.55 IC1.5
N$38
  Top 0.203: IC2.6 22.23,38.73 13.97,38.73 12.06,40.64 11.27,40.64 10,41.91 10,42.55 IC1.6
N$39
  Top 0.203: IC2.7 22.23,38.1 20.95,38.1 20.8,38.26 13.81,38.26 12.7,39.37 11.27,39.37 8.73,41.91 8.73,42.55 IC1.7
N$40  (via drill 0.41)
  Top 0.203: v23.65,37.78 23.34,37.47 22.38,37.47 IC2.8 | v13.34,37.78 11.59,37.78 7.46,41.91 7.46,42.55 IC1.8
  Bottom 0.203: v13.34,37.78 v23.65,37.78
N$49
  Top 0.406: K1.S1 12.86,25.4 13.02,25.4 13.97,24.45 13.97,5.71 12.86,4.6 X1.2
  Bottom 0.406: D16.1 12.06,5.71 12.06,5.24 12.7,4.6 X1.2
N$55  (via drill 0.61)
  Top 0.406: v9.53,2.06 24.29,2.06 26.67,4.45 X2.1
  Bottom 0.406: D12.1 26.04,5.71 26.04,5.24 26.67,4.6 X2.1 | v9.53,2.06 7.62,3.97 7.62,5.08 7.94,5.4 7.94,12.7 12.7,17.46 12.7,18.89 K5.S1
N$60  (via drill 0.61)
  Top 0.406: v18.26,9.21 v24.92,15.88
  Bottom 0.406: X1.3 16.19,4.6 15.56,5.24 15.56,5.71 D9.1 15.56,6.03 15.56,6.19 18.26,8.89 v18.26,9.21 | v24.92,15.88 24.92,24.13 23.65,25.4 23.5,25.4 K2.S1
N$61  (via drill 0.61)
  Top 0.406: v35.24,14.92 32.86,14.92 28.26,10.32 27.15,10.32 24.77,7.94 24.77,3.81 23.97,3.02 21.27,3.02 19.84,4.45 X1.4
  Bottom 0.406: D10.1 19.05,5.71 19.05,5.24 19.68,4.6 X1.4 | v35.24,14.92 35.24,24.45 34.29,25.4 34.13,25.4 K3.S1
N$62  (via drill 0.61)
  Top 0.406: v45.63,33.02 47.69,30.96 47.69,5.24 45.47,3.02 v27.85,3.02
  Bottom 0.406: D11.1 22.54,5.71 22.54,5.24 23.18,4.6 X1.5 23.4,4.45 25.94,1.91 26.74,1.91 v27.85,3.02 | v45.63,33.02 43.72,31.11 43.72,30 44.68,29.05 44.68,25.56 K4.S1
N$64
  Bottom 0.406: X2.2 30.16,4.6 29.53,5.24 29.53,5.71 D13.1 29.37,5.87 27.94,7.3 27.94,7.78 26.51,9.21 26.51,12.22 23.5,15.24 23.5,18.89 K6.S1
N$65
  Bottom 0.406: X2.3 33.66,4.6 33.02,5.24 33.02,5.71 D14.1 33.02,6.03 33.97,6.99 33.97,7.94 35.24,9.21 35.24,9.84 35.08,10 35.08,13.65 34.13,14.61 34.13,18.89 K7.S1
N$66
  Bottom 0.406: X2.4 37.15,4.6 36.51,5.24 36.51,5.71 D15.1 36.51,6.03 42.23,6.03 45.94,9.74 45.94,14.05 44.93,14.76 44.93,18.89 K8.S1
VIN
  Top 0.61: SERIAL.6 35.94,32.81 36.75,32 45.25,32 46.75,30.5 46.75,5.5 45.75,4.5 X2.5

### Text on the board
_tsilk: 1
_bsilk: PCB-MicroGPIO v03-16